# EAGLE design backscatter_tag_v2 (EAGLE 7.3.0)
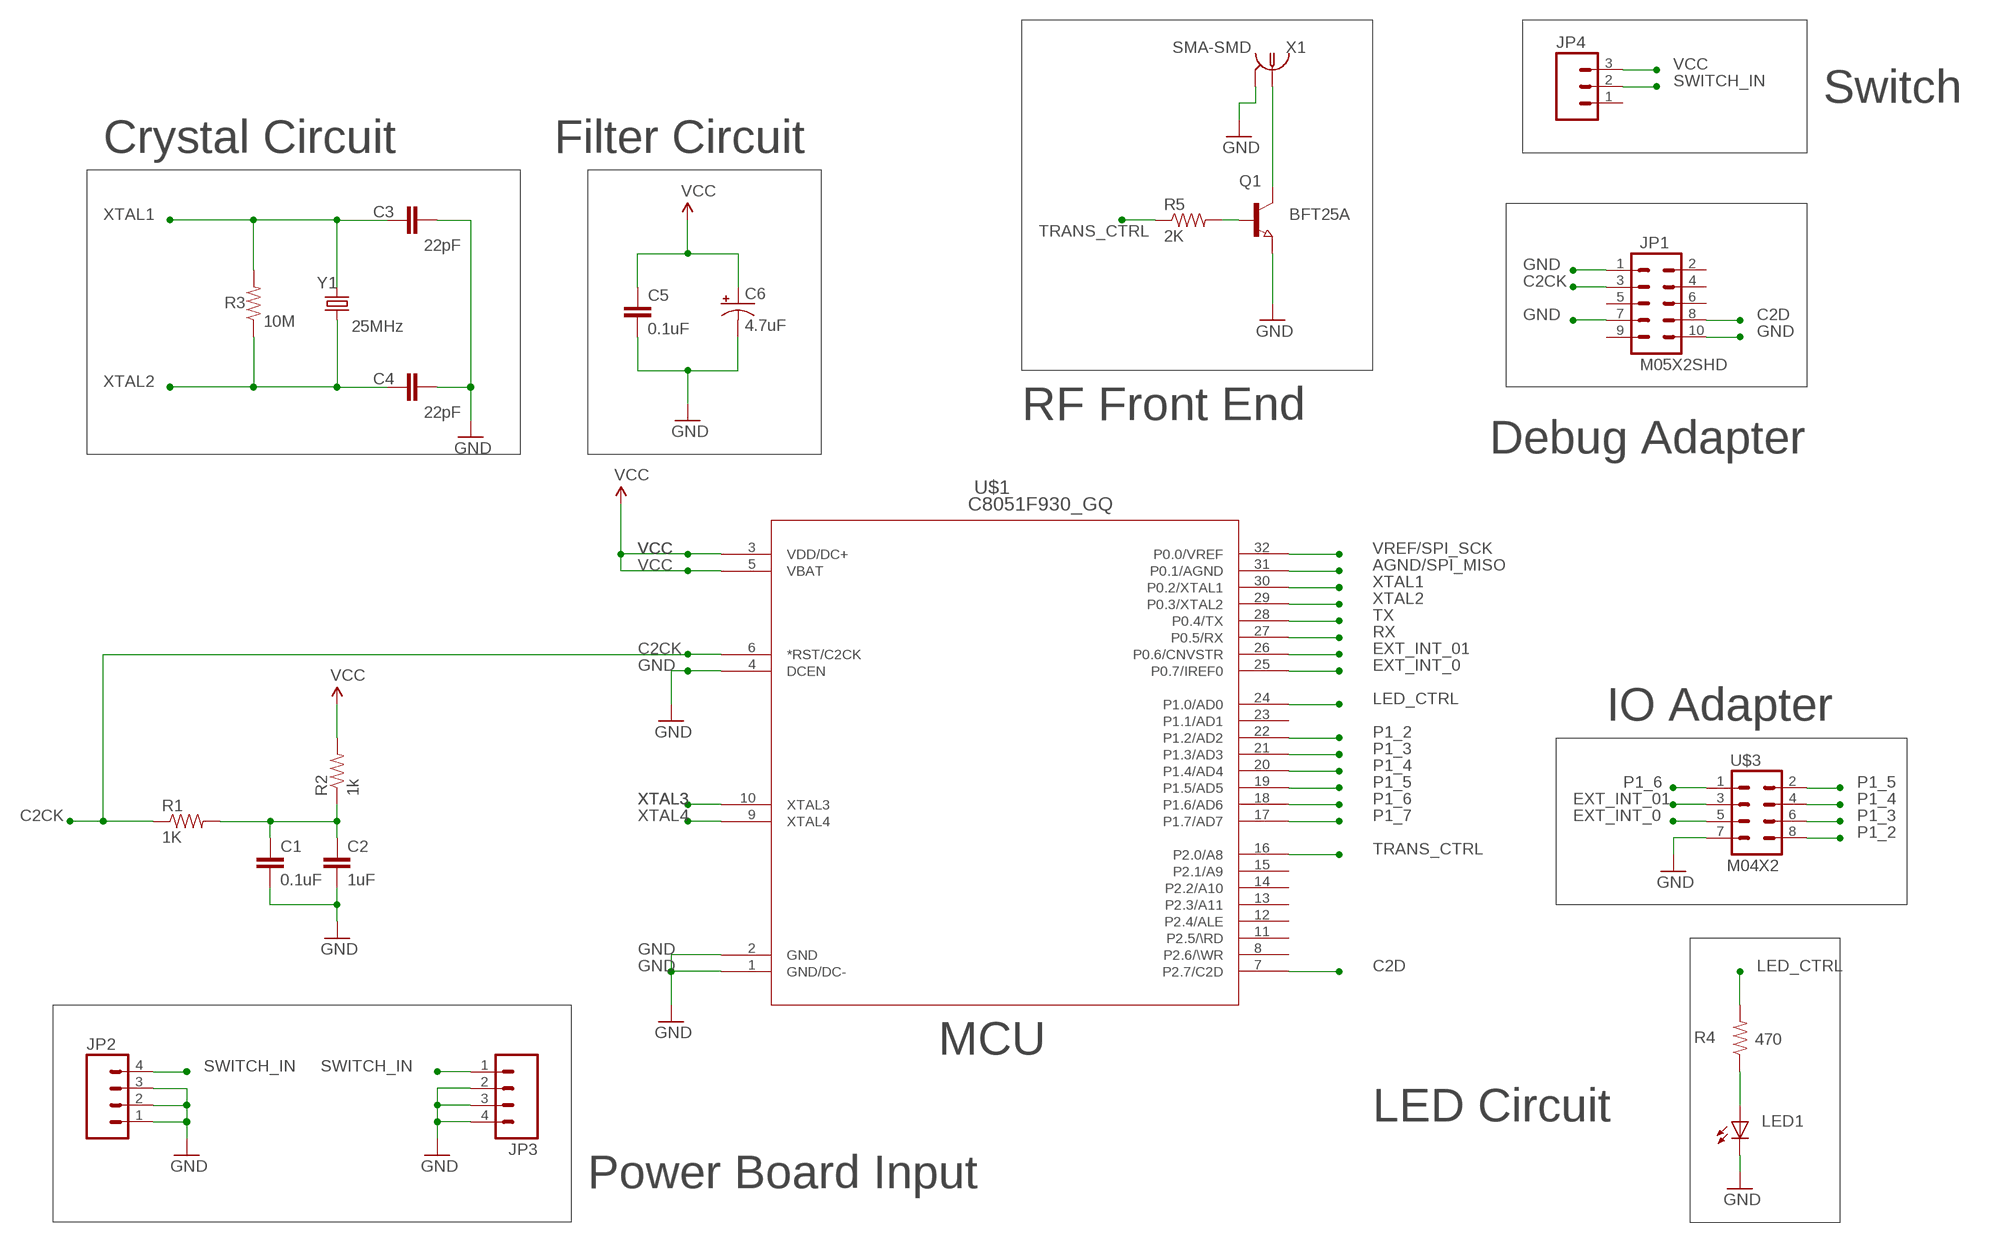
[diagram p0: schematic, sheet 1]

## Parts
C1  0.1uF  CAP0805  [0805]
C2  1uF  CAP0805  [0805]
C3  22pF  CAP0805  [0805]
C4  22pF  CAP0805  [0805]
C5  0.1uF  CAP0805  [0805]
C6  4.7uF  CAP_POL1206  [EIA3216]
JP1  M05X2SHD  [2X5-SHROUDED]
JP2  M04LOCK  [1X04_LOCK]
JP3  M04LOCK  [1X04_LOCK]
JP4  M03LOCK  [1X03_LOCK]
LED1  LED-FKIT-1206  [FKIT-LED-1206]
Q1  BFT25A  NPN-TRANSISTOR_SOT23  [SOT23]
R1  1K  RESISTOR0805-RES  [0805]
R2  1k  RESISTOR0805-RES  [0805]
R3  10M  RESISTOR0805-RES  [0805]
R4  470  RESISTOR0805-RES  [0805]
R5  2K  RESISTOR0603-RES  [0603-RES]
U$1  C8051F930_GQ  [QFP32-7X7-0P8MM]
U$3  M04X2  [2X4]
X1  SMA-SMD  [SMA-SMD]
Y1  25MHz  CRYSTALHC49US  [HC49US]

## Nets
AGND/SPI_MISO: U$1.31(P0.1/AGND)
C2CK: JP1.3 R1.1 U$1.6(*RST/C2CK)
C2D: JP1.8 U$1.7(P2.7/C2D)
EXT_INT_0: U$1.25(P0.7/IREF0) U$3.5
EXT_INT_01: U$1.26(P0.6/CNVSTR) U$3.3
GND: C1.2 C2.2 C3.2 C4.2 C5.2 C6.C(-) JP1.1 JP1.7 JP1.10 JP2.1 JP2.2 JP2.3 JP3.2 JP3.3 JP3.4 LED1.C Q1.2(E) U$1.1(GND/DC-) U$1.2(GND) U$1.4(DCEN) U$3.7 X1.2@1 X1.2@2 X1.2@3 X1.2@4 X1.2@5 X1.2@6
LED_CTRL: R4.2 U$1.24(P1.0/AD0)
N$1: C1.1 C2.1 R1.2 R2.1
N$2: LED1.A R4.1
N$3: Q1.1(B) R5.2
N$4: Q1.3(C) X1.1
P1_2: U$1.22(P1.2/AD2) U$3.8
P1_3: U$1.21(P1.3/AD3) U$3.6
P1_4: U$1.20(P1.4/AD4) U$3.4
P1_5: U$1.19(P1.5/AD5) U$3.2
P1_6: U$1.18(P1.6/AD6) U$3.1
P1_7: U$1.17(P1.7/AD7)
RX: U$1.27(P0.5/RX)
SWITCH_IN: JP2.4 JP3.1 JP4.2
TRANS_CTRL: R5.1 U$1.16(P2.0/A8)
TX: U$1.28(P0.4/TX)
VCC: C5.1 C6.A(+) JP4.3 R2.2 U$1.3(VDD/DC+) U$1.5(VBAT)
VREF/SPI_SCK: U$1.32(P0.0/VREF)
XTAL1: C3.1 R3.2 U$1.30(P0.2/XTAL1) Y1.2
XTAL2: C4.1 R3.1 U$1.29(P0.3/XTAL2) Y1.1
XTAL3: U$1.10(XTAL3)
XTAL4: U$1.9(XTAL4)
Unconnected: JP1.2 JP1.4 JP1.5 JP1.6 JP1.9 JP4.1 U$1.8(P2.6/\WR) U$1.11(P2.5/\RD) U$1.12(P2.4/ALE) U$1.13(P2.3/A11) U$1.14(P2.2/A10) U$1.15(P2.1/A9) U$1.23(P1.1/AD1)

## Notes on the sheet
- Switch
- Crystal Circuit | Filter Circuit
- RF Front End
- Debug Adapter
- IO Adapter
- MCU
- LED Circuit
- Power Board Input

## Library data of the parts
C1 C2 = SparkFun:CAP: Capacitor Standard 0603 ceramic capacitor, and 0.1" leaded capacitor.
C3-C5 = SparkFun-Capacitors:CAP: Capacitor Standard 0603 ceramic capacitor, and 0.1" leaded capacitor.
C6 = SparkFun-Capacitors:CAP_POL: Capacitor Polarized These are standard SMD and PTH capacitors. Normally 10uF, 47uF, and 100uF in electrolytic and tantalum varieties. Always verify the external diameter of the through hole cap, it varies with capacity, voltage, and manufacturer. The EIA devices should be standard.
JP1 = SparkFun-Connectors:M05X2: Header 5x2 Standard 10-pin dual row 0.1" header. Commonly used with AVR-ISP. Use with Spark Fun Electronics SKU: PRT-00778
JP2 JP3 = SparkFun-Connectors:M04: Header 4 Standard 4-pin 0.1" header. Use with straight break away headers (SKU : PRT-00116), right angle break away headers (PRT-00553), swiss pins (PRT-00743), machine pins (PRT-00117), and female headers (PRT-00115). Molex polarized connector foot print use with SKU : PRT-08231 with associated crimp pins and housings. 1MM SMD Version SKU: PRT-10208
JP4 = SparkFun-Connectors:M03: Header 3 Standard 3-pin 0.1" header. Use with straight break away headers (SKU : PRT-00116), right angle break away headers (PRT-00553), swiss pins (PRT-00743), machine pins (PRT-00117), and female headers (PRT-00115). Molex polarized connector foot print use with SKU : PRT-08232 with associated crimp pins and housings.
LED1 = SparkFun-LED:LED: LEDs Standard schematic elements and footprints for 5mm, 3mm, 1206, and 0603 sized LEDs. 5mm - Spark Fun Electronics SKU : COM-00529 (and others)
Q1 = semicon-smd-ipc:NPN-TRANSISTOR_: NPN TRANSISTOR
R1 R2 = SparkFun:RESISTOR: Resistor Basic schematic elements and footprints for 0603, 1206, and PTH resistors.
R3-R5 = SparkFun-Resistors:RESISTOR: Resistor Basic schematic elements and footprints for 0603, 1206, and PTH resistors.
U$1 = silabs_f930:C8051F930_GQ; PARTDESC: CHIP, MCU,QFN32-7X7, RoHS.; PARTNUMBER: C8051F930_GQ
U$3 = SparkFun-Connectors:M04X2: .1" header, two rows of four.
X1 = con-coax:SMA-SMD: SMA 50 Ohm Straight Jack Receptacle - Surface Mount www.johnsoncomponents.com Source: http://catalog.digikey.com .. 142-0711-201, 205, 202, 206.pdf; OC_FARNELL: unknown; OC_NEWARK: unknown
Y1 = SparkFun-FreqCtrl:CRYSTAL: Various standard crystals. Proven footprints. Spark Fun Electronics SKU : COM-00534

## Board
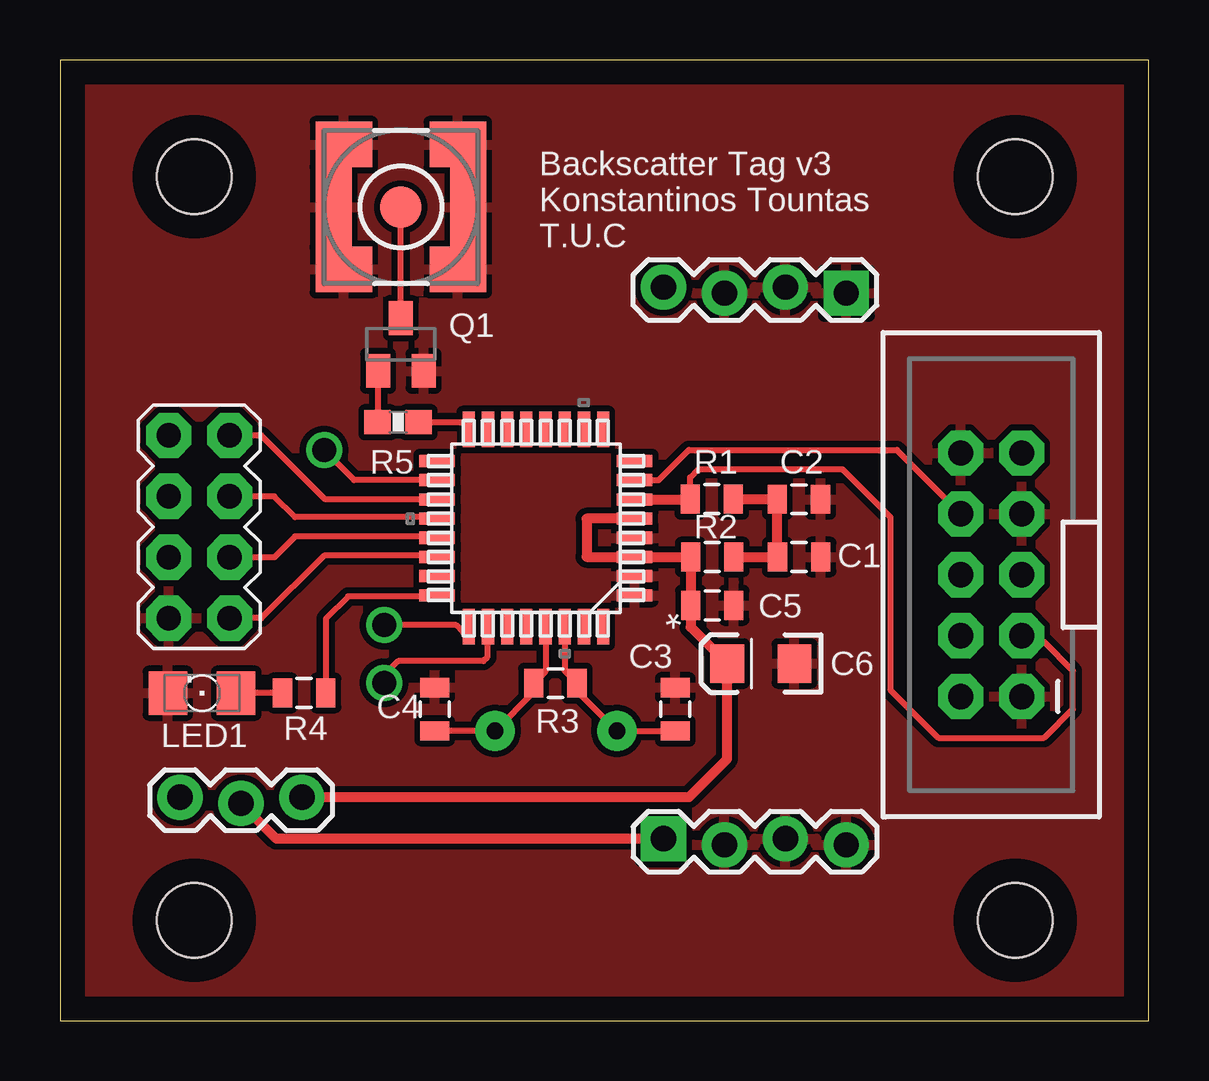
[diagram p1: board, top side]
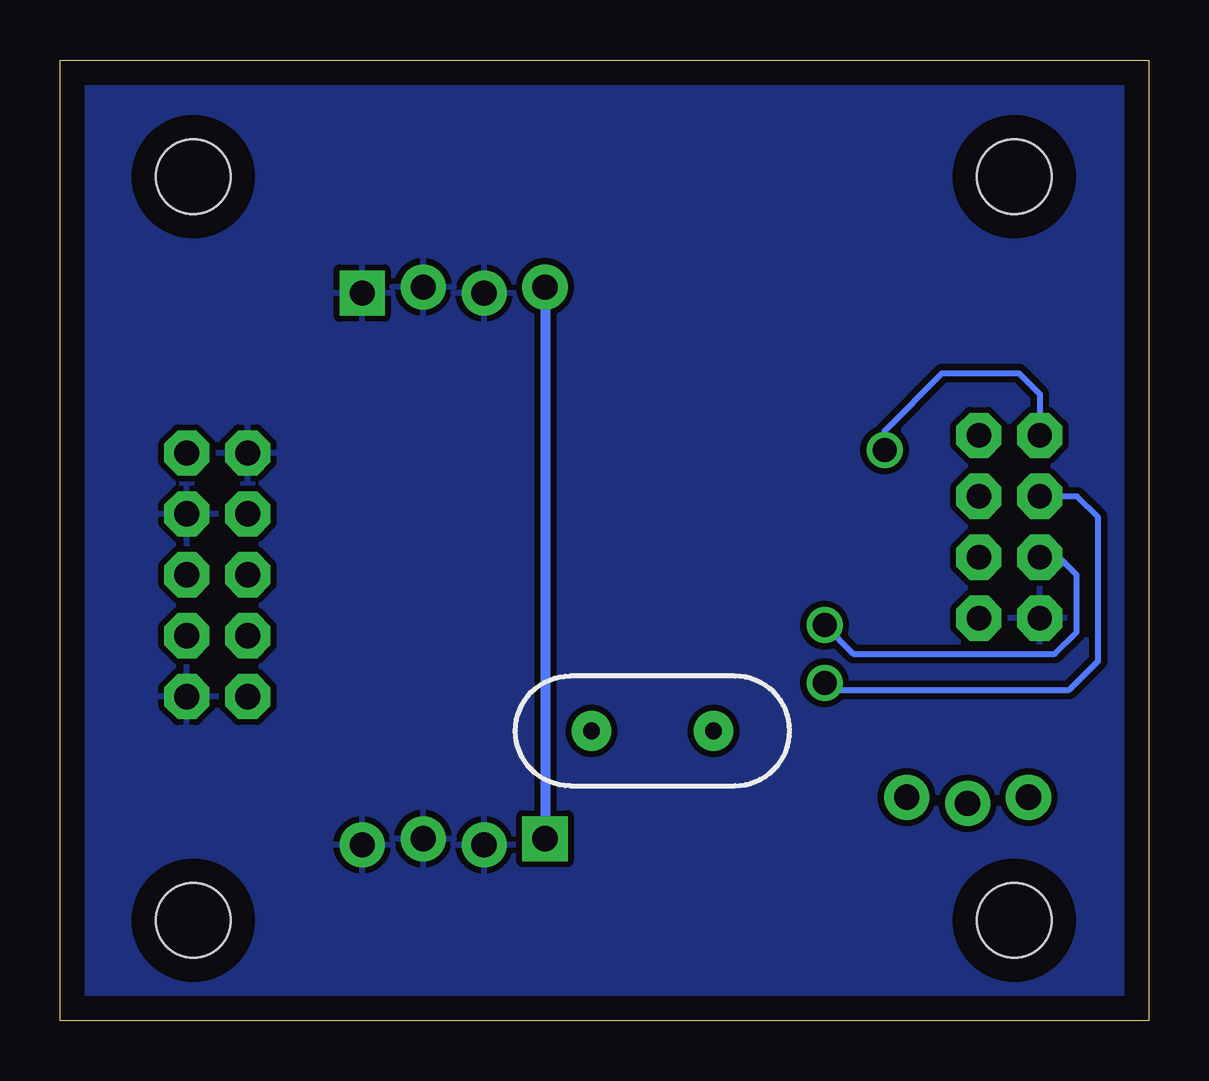
[diagram p2: board, bottom side, seen from below]

Size 45.36 x 40.04 mm. Coordinates in mm from the lower left corner, seen from the top.
Outline: 0,0 45.35,0 45.35,40.04 0,40.04 0,0
Copper layers (1*16): Top 0.035mm / dielectric 1.5mm / Bottom 0.035mm
Design rules "default *": minimum track width 8mil, minimum drill 24mil, track to track 10mil, track to pad 10mil, pad to pad 10mil, via to via 10mil, smd to smd 10mil, copper to edge 40mil, drill to drill 8mil, minimum pad ring 10mil, minimum via ring 8mil, stop-mask expansion 4mil, vias tented up to drill 0mil, thermal gap 10mil
Holes 3.1 mm at 5.6,35.19 39.8,35.19 5.6,4.19 39.8,4.19

### Footprints (pad centres in the part's own frame; a part is rotated, then mirrored left to right if it is on the bottom)
0805 = smd 0.8 x 1.2: 1 -0.9,0; 2 0.9,0
EIA3216 = smd 1.4 x 1.6: A 1.4,0; C -1.4,0
2X5-SHROUDED = drill 1.05 pad 1.88 octagon: 1 -1.27,5.08; 2 1.27,5.08; 3 -1.27,2.54; 4 1.27,2.54; 5 -1.27,0; 6 1.27,0; 7 -1.27,-2.54; 8 1.27,-2.54; 9 -1.27,-5.08; 10 1.27,-5.08
1X04_LOCK = drill 1.05 pad 1.88 square: 1 0,0.127 | drill 1.05 pad 1.88: 2 2.54,-0.127; 3 5.08,0.127; 4 7.62,-0.127
1X03_LOCK = drill 1.05 pad 1.88: 1 0,0.127; 2 2.54,-0.127; 3 5.08,0.127
FKIT-LED-1206 = smd 1.6 x 1.803: A -1.422,0; C 1.422,0
SOT23 = smd 1 x 1.4: 1 -0.95,-1.1; 2 0.95,-1.1; 3 0,1.1
0603-RES = smd 1.1 x 1: 1 -0.85,0; 2 0.85,0
QFP32-7X7-0P8MM = smd 1.473 x 0.508: 1 -4.115,2.8; 2 -4.115,2; 3 -4.115,1.2; 4 -4.115,0.4; 5 -4.115,-0.4; 6 -4.115,-1.2; 7 -4.115,-2; 8 -4.115,-2.8; 17 4.115,-2.8; 18 4.115,-2; 19 4.115,-1.2; 20 4.115,-0.4; 21 4.115,0.4; 22 4.115,1.2; 23 4.115,2; 24 4.115,2.8 | smd 0.508 x 1.473: 9 -2.8,-4.115; 10 -2,-4.115; 11 -1.2,-4.115; 12 -0.4,-4.115; 13 0.4,-4.115; 14 1.2,-4.115; 15 2,-4.115; 16 2.8,-4.115; 25 2.8,4.115; 26 2,4.115; 27 1.2,4.115; 28 0.4,4.115; 29 -0.4,4.115; 30 -1.2,4.115; 31 -2,4.115; 32 -2.8,4.115
2X4 = drill 1.016 pad 1.88 octagon: 1 -3.81,-1.27; 2 -3.81,1.27; 3 -1.27,-1.27; 4 -1.27,1.27; 5 1.27,-1.27; 6 1.27,1.27; 7 3.81,-1.27; 8 3.81,1.27
SMA-SMD = smd 1.73 x 1.73: 1 0,0 | smd 2.35 x 1.9: 2@1 -2.375,2.6; 2@2 -2.375,-2.6; 2@3 2.375,-2.6; 2@4 2.375,2.6 | smd 1.5 x 3.4: 2@5 -2.8,0; 2@6 2.8,0
HC49US = drill 0.7 pad 1.651: 1 -2.54,0; 2 2.54,0

### Placement (x,y rotation side)
C1  30.8,19.33 0 top
C2  30.79,21.73 0 top
C3  25.64,12.98 90 top
C4  15.62,12.98 90 top
C5  27.18,17.31 0 top
C6  29.2,14.88 180 top
JP1  38.8,18.59 180 top
JP2  32.77,30.45 180 top
JP3  25.15,7.46 0 top
JP4  5,9.19 0 top
LED1  5.92,13.65 180 top
Q1  14.2,28.19 0 top
R1  27.16,21.74 0 top
R2  27.18,19.33 180 top
R3  20.64,14.07 0 top
R4  10.17,13.66 0 top
R5  14.09,24.95 180 top
U$1  19.83,20.53 180 top
U$3  5.8,20.59 270 top
X1  14.21,33.92 0 top
Y1  20.67,12.08 180 bottom

### Tracks (layer width: path | path; a pad name or v marks a point on that pad's centre or on a via)
C2CK
  Top 0.254: R1.1 26.25,22.64 26.6,22.99 32.6,22.99 34.6,20.99 34.6,13.79 36.6,11.79 41,11.79 42.2,12.99 42.2,14.59 41,15.79 40.33,15.79 JP1.3
  Top 0.406: U$1.6 R1.1
C2D
  Top 0.254: U$1.7 24.94,22.53 26.2,23.79 34.87,23.79 JP1.8
EXT_INT_0  (via drill 1)
  Top 0.254: U$1.25 16.8,16.19 | 16.8,16.19 | 16.8,16.19 16.5,16.49 v13.5,16.49
  Bottom 0.254: v13.5,16.49 12.3,15.29 3.9,15.29 3,16.19 3,18.59 3.73,19.32 U$3.5
EXT_INT_01  (via drill 1)
  Top 0.254: U$1.26 17.79,16.38 17.79,15.13 17.64,14.99 14.1,14.99 13.5,14.39 v13.5,14.09
  Bottom 0.254: v13.5,14.09 13.2,13.79 3.3,13.79 2.1,14.99 2.1,20.99 2.97,21.86 U$3.3
GND
  pour Top (isolate 0.254): -2.2,87.89 108.2,87.89 108.2,-24.61 -2.2,-24.61
  pour Bottom (isolate 0.254): 0.8,86.09 112.4,86.09 112.4,-9.31 0.8,-9.31
LED_CTRL
  Top 0.254: U$1.24 15.34,17.73 15.3,17.69 12,17.69 11.07,16.76 R4.2 11.27,13.66
N$1
  Top 0.406: C1.1 C2.1 R1.2 | R2.1 C1.1 | C1.1
N$2
  Top 0.254: R4.1 LED1.A
N$3
  Top 0.254: R5.2 Q1.1
N$4
  Top 0.254: Q1.3 X1.1
P1_2
  Top 0.254: U$1.22 15.66,19.39 11,19.39 8.39,16.78 U$3.8
P1_3
  Top 0.254: U$1.21 15.66,20.19 9.8,20.19 8.93,19.32 U$3.6
P1_4
  Top 0.254: U$1.20 15.66,20.99 9.8,20.99 8.93,21.86 U$3.4
P1_5
  Top 0.254: U$1.19 11.06,21.73 8.39,24.4 U$3.2
P1_6  (via drill 1)
  Top 0.254: U$1.18 12.26,22.53 v11,23.79
  Bottom 0.254: v11,23.79 11,24.59 8.6,26.99 5.4,26.99 4.53,26.12 U$3.1
SWITCH_IN
  Top 0.406: JP3.1 9.02,7.58 JP4.2
  Bottom 0.406: 25.59,30.58 JP2.4 JP3.1
TRANS_CTRL
  Top 0.254: R5.1 17.03,24.95 U$1.16
VCC
  Top 0.406: U$1.5 21.94,20.93 21.94,19.33 U$1.3 R2.2 C5.1 26.28,16.41 C6.A 27.8,10.91 26.2,9.31 JP4.3
XTAL1
  Top 0.254: U$1.30 21.03,14.58 R3.2 | R3.2 21.54,13.73 | Y1.2 21.54,13.74 R3.2 | Y1.2 | Y1.2 C3.1
XTAL2
  Top 0.254: U$1.29 20.23,14.56 R3.1 | R3.1 19.74,13.69 | R3.1 19.74,13.69 Y1.1 18.11,12.08 C4.1

### Text on the board
tPlace: Backscatter Tag v3 / Konstantinos Tountas / T.U.C
tNames: Q1 | R5 | R1 | C2 | R2 | C1 | C5 | C3 | C6 | C4 | R3 | LED1 | R4